# EAGLE design MC34063-STEPUP-02 (EAGLE 5.02)
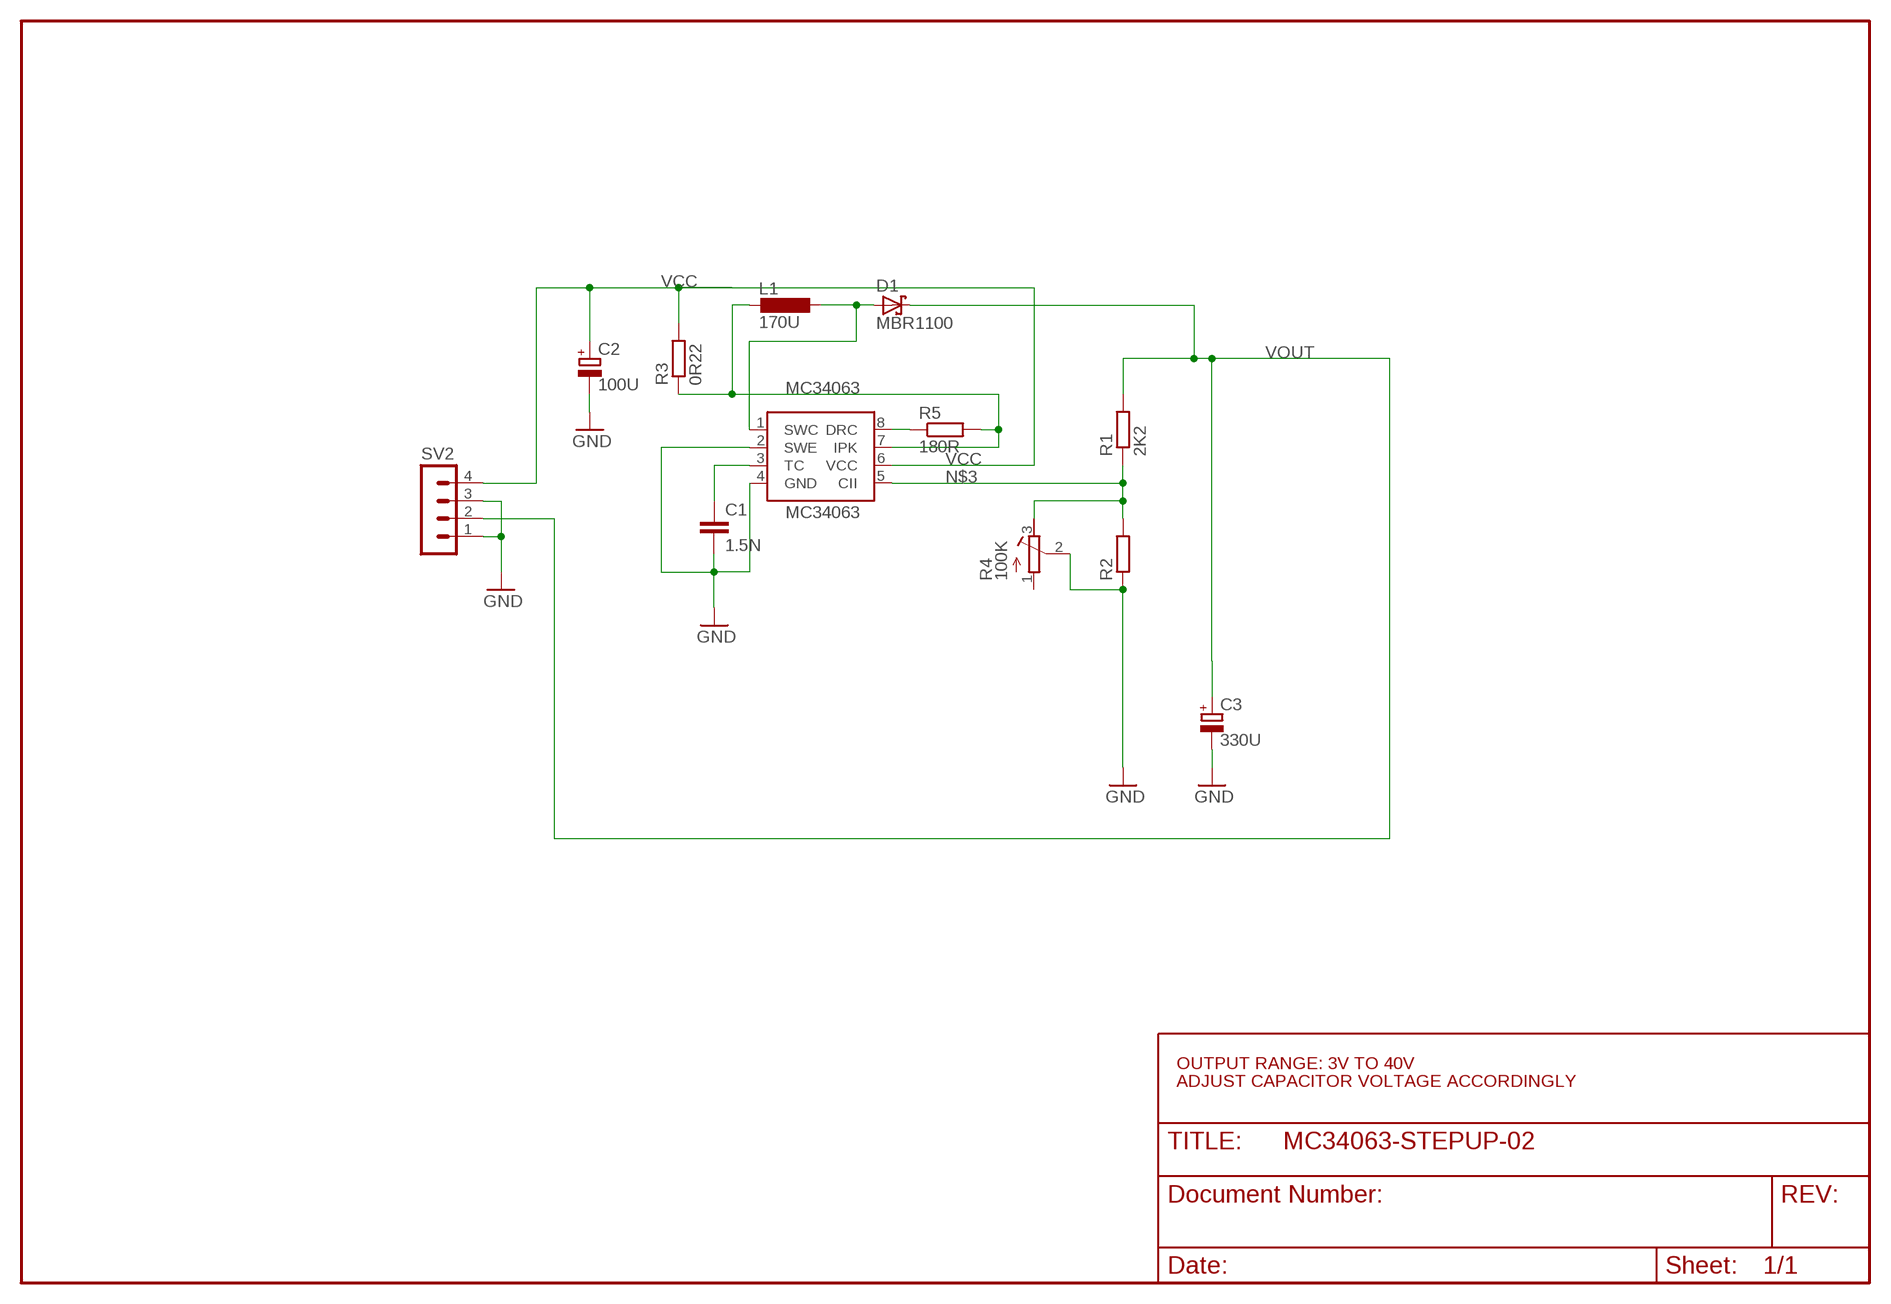
[diagram p0: schematic, sheet 1]

## Parts
C1  1.5N  C-EUC0805  [C0805]
C2  100U  CPOL-EUCT7343  [CT7343]
C3  330U  CPOL-EUCT7343  [CT7343]
D1  MBR1100  MBRS130LT3  [SMB]
L1  170U  L  [POWERINDUCTOR1]
MC34063  MC34063  [SO08]
R1  2K2  R-EU_0204/2V  [0204V]
R2  R-EU_0204/2V  [0204V]
R3  0R22  R-EU_R2010  [R2010]
R4  100K  R-TRIMM64Y  [RTRIM64Y]
R5  180R  R-EU_M0805  [M0805]
SV2  MA04-1  [MA04-1]

## Nets
GND: C1.2 C2.- C3.- MC34063.2(SWE) MC34063.4(GND) R2.1 R4.2(S) SV2.1 SV2.3
N$1: MC34063.8(DRC) R5.1
N$2: D1.A L1.P$1 MC34063.1(SWC)
N$3: MC34063.5(CII) R1.1 R2.2 R4.3(A)
N$6: C1.1 MC34063.3(TC)
VCC: C2.+ MC34063.6(VCC) R3.2 SV2.4
VIN: L1.P$2 MC34063.7(IPK) R3.1 R5.2
VOUT: C3.+ D1.C R1.2 SV2.2
Unconnected: R4.1(E)

## Notes on the sheet
- OUTPUT RANGE: 3V TO 40V
- ADJUST CAPACITOR VOLTAGE ACCORDINGLY

## Library data of the parts
C1 = turbod3:C-EU: CAPACITOR, European symbol
C2 C3 = turbod3:CPOL-EU: POLARIZED CAPACITOR, European symbol
D1 = turbod3:MBRS130LT3: Schottky Power Rectifier Source: http://www.onsemi.com/pub/Collateral/MBRS130LT3-D.PDF
L1 = turbod3:L
MC34063 = turbod3:MC34063
R1-R3 R5 = turbod3:R-EU_: RESISTOR, European symbol
R4 = rcl:R-TRIMM: Trimm resistor
SV2 = con-lstb:MA04-1: PIN HEADER

## Board
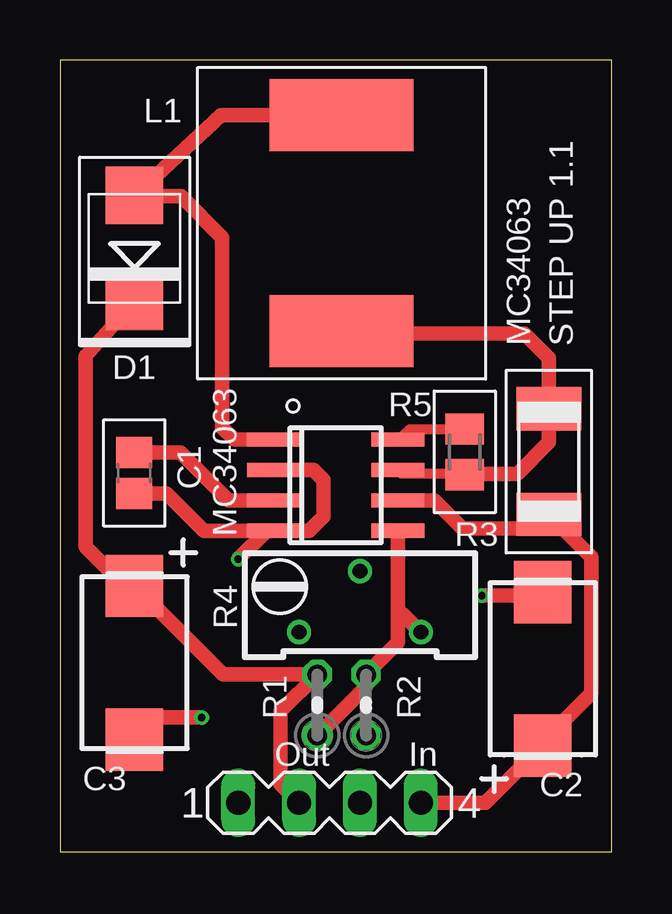
[diagram p1: board, top side]
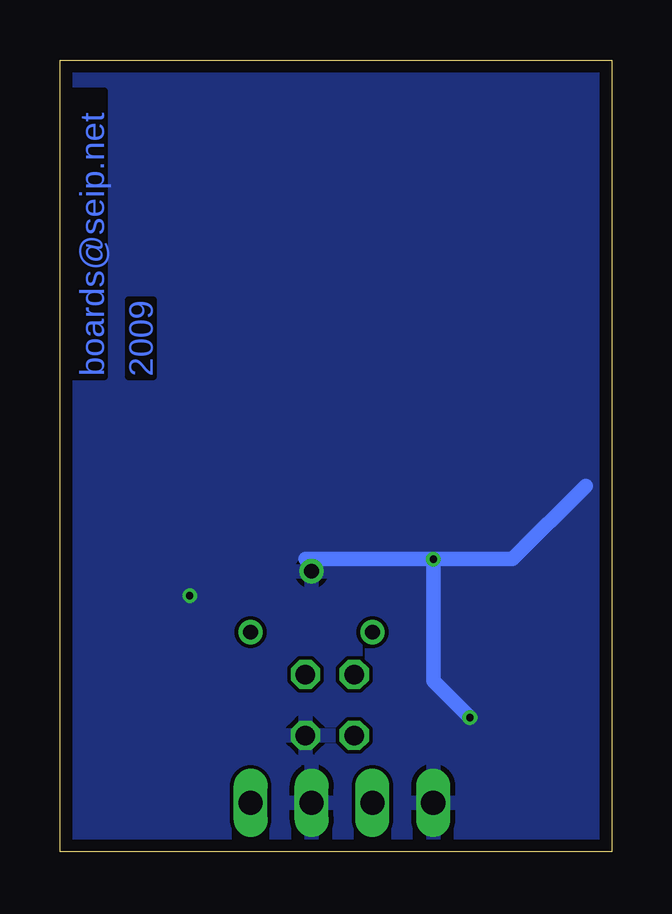
[diagram p2: board, bottom side, seen from below]

Size 23 x 33 mm. Coordinates in mm from the lower left corner, seen from the top.
Outline: 0,0 23,0 23,33 0,33 0,0
Copper layers (1*16): Top 0.035mm / dielectric 1.5mm / Bottom 0.035mm
Design rules "PCB-POOL": minimum track width 6mil, minimum drill 12mil, track to track 6mil, track to pad 6mil, pad to pad 6mil, via to via 6mil, smd to smd 6mil, copper to edge 20mil, drill to drill 8mil, minimum pad ring 8mil, minimum via ring 6mil, stop-mask expansion 3mil, vias tented up to drill 0mil, thermal gap 8mil

### Footprints (pad centres in the part's own frame; a part is rotated, then mirrored left to right if it is on the bottom)
C0805 = smd 1.3 x 1.5: 1 -0.85,0; 2 0.85,0
CT7343 = smd 2.6 x 2.4: + 3.2,0; - -3.2,0
SMB = smd 2.4 x 2.4: A 2.2,0; C -2.2,0
POWERINDUCTOR1 = smd 3 x 6: P$1 -4.5,0; P$2 4.5,0
SO08 = smd 0.6 x 2.2: 1 -1.905,-2.6; 2 -0.635,-2.6; 3 0.635,-2.6; 4 1.905,-2.6; 5 1.905,2.6; 6 0.635,2.6; 7 -0.635,2.6; 8 -1.905,2.6
0204V = drill 0.813 octagon: 1 -1.27,0; 2 1.27,0
R2010 = smd 1.8 x 2.7: 1 -2.2,0; 2 2.2,0
RTRIM64Y = drill 0.61 round: 1 0,-2.54; 2 -2.54,0; 3 0,2.54
M0805 = smd 1.3 x 1.6: 1 -0.95,0; 2 0.95,0
MA04-1 = drill 1.016 long: 1 -3.81,0; 2 -1.27,0; 3 1.27,0; 4 3.81,0

### Placement (x,y rotation side)
C1  3.1,15.78 270 top
C2  20.13,7.62 270 top
C3  3.11,7.87 90 top
D1  3.11,25.15 90 top
L1  11.75,26.19 270 top
MC34063  11.49,15.27 270 top
R1  10.73,6.11 90 top
R2  12.76,6.11 90 top
R3  20.38,16.26 270 top
R4  12.51,9.14 270 top
R5  16.88,16.66 270 top
SV2  11.24,2.03 0 top

### Tracks (layer width: path | path; a pad name or v marks a point on that pad's centre or on a via)
GND  (via drill 0.3)
  Top 0.61: 3.04,14.99 C1.2 4.44,14.93 6.01,13.36 8.58,13.36 MC34063.4 | MC34063.4 8.61,13.37 v7.43,12.19 | 20.13,10.67 C2.- 20.13,10.67 | v17.59,10.67 18.35,10.67 19.11,10.67 | 19.11,10.67 18.61,10.67 19.11,10.67 | 19.11,10.67 20.13,10.67 | 20.13,10.67 20.38,10.67 | v5.91,5.59 4.03,5.59 C3.- | R2.1 12.78,4.84 | MC34063.2 10.58,15.9 10.99,15.49 10.99,13.97 10.38,13.37 MC34063.4
  Bottom 0.406: R4.2 12.51,11.94 12.76,12.19
  Bottom 0.61: v7.43,12.19 12.76,12.19 | v7.43,12.19 7.43,7.11 v5.91,5.59 | 1.08,15.24 4.13,12.19 v7.43,12.19
  pour Bottom: 0.06,33.02 0.06,0 22.92,0 22.92,33.02
N$1
  Top 0.406: 14.13,17.18 MC34063.8 14.13,17.18 | 14.13,17.18 14.14,17.17 14.58,17.61 R5.1
N$2
  Top 0.61: L1.P$1 6.71,30.69 D1.A 2.92,27.35 2.81,27.23 2.91,27.33 5.04,27.33 6.77,25.6 6.77,17.68 7.27,17.18 MC34063.1
N$3
  Top 0.61: 14.09,9.92 MC34063.5 | 14.09,9.92 14.28,9.92 R4.3 | 14.09,9.92 14.09,8.71 R2.2 12.76,6.87 R1.1
N$6
  Top 0.61: C1.1 5.02,16.63 7.02,14.63 MC34063.3
VCC
  Top 0.61: SV2.4 17.74,2.03 C2.+ 20.13,4.57 22.16,6.6 22.16,12.28 R3.2 19.96,14.06 19.37,13.46 16.78,13.46 15.61,14.63 14.14,14.63 14.13,14.64 MC34063.6
VIN
  Top 0.406: MC34063.7 14.24,15.75 16.73,15.75
  Top 0.61: L1.P$2 11.75,21.59 19.37,21.59 20.38,20.57 20.38,18.54 R3.1 20.38,17.07 19.06,15.75 16.73,15.75 16.76,15.71 R5.2
VOUT
  Top 0.61: SV2.2 9.21,2.79 9.21,5.08 9.21,5.86 R1.2 6.8,7.38 6.24,7.95 | 6.24,7.95 C3.+ 2.71,11.07 1.08,12.7 1.08,20.66 D1.C | 6.24,7.95 6.4,7.79

### Text on the board
Bottom: 2009 | boards@seip.net
tNames: MC34063 | STEP UP 1.1 | Out | In